# EAGLE design Control board V3 (EAGLE 8.3.2)
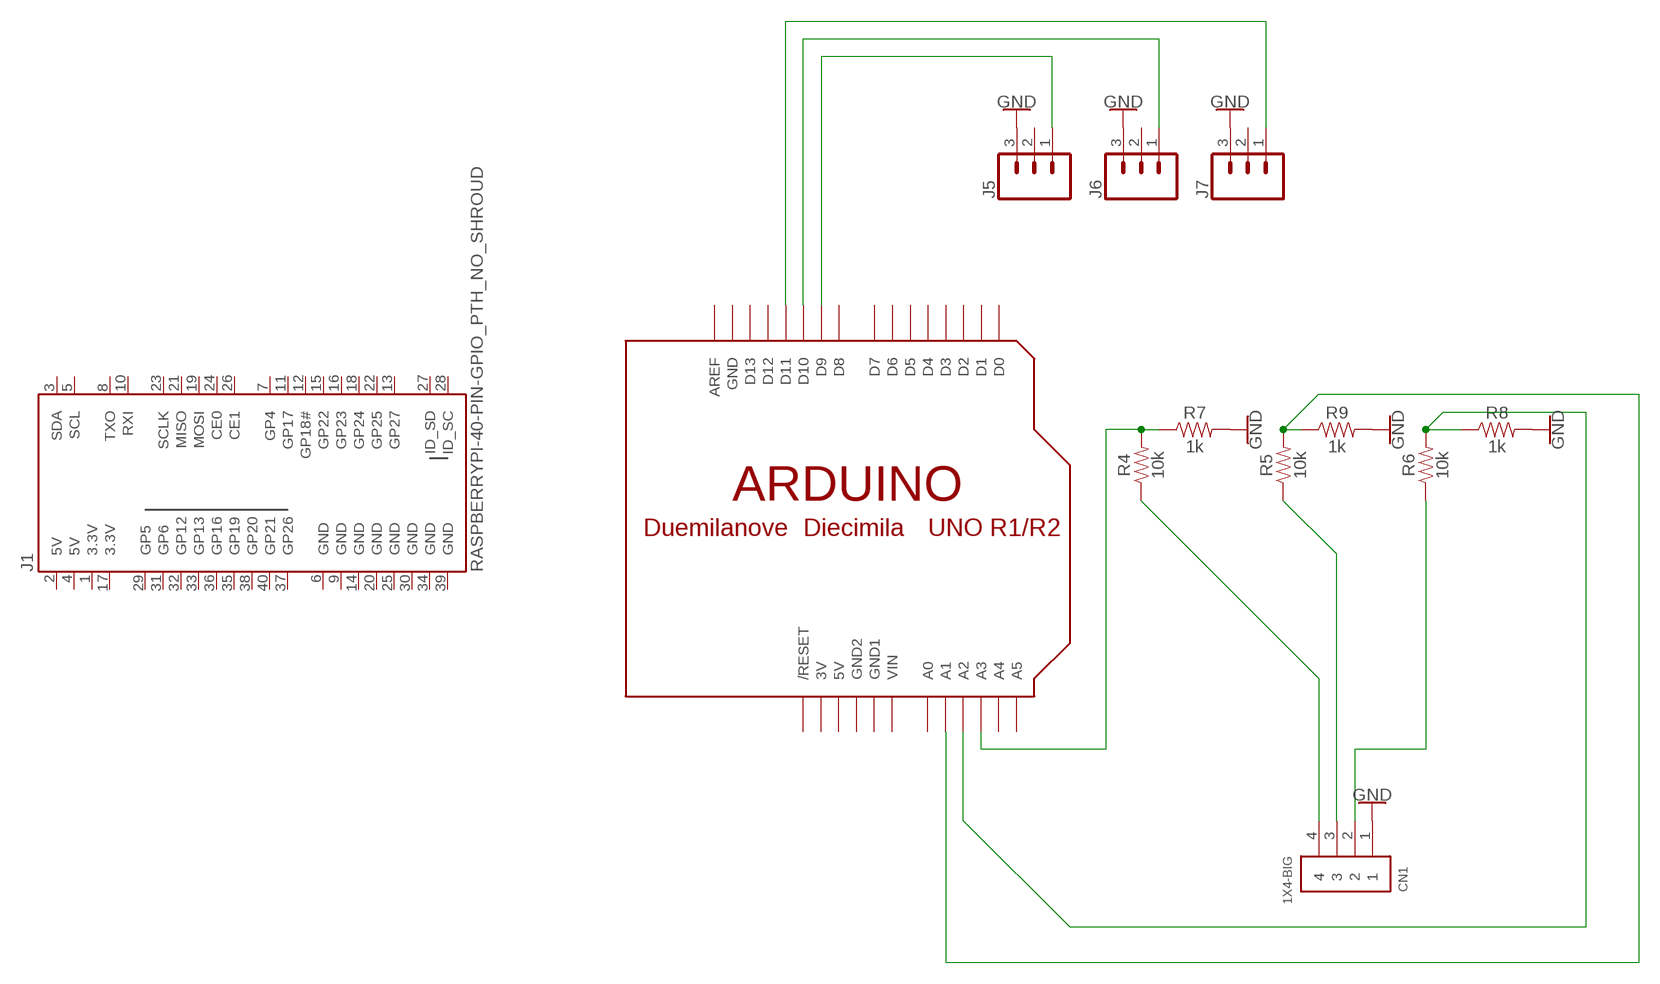
[diagram p0: schematic, sheet 1]

## Parts
CN1  1X4-BIG  [1X04-BIG]
J1  RASPBERRYPI-40-PIN-GPIO_PTH_NO_SHROUD  [2X20]
J5  CONN_03  [1X03]
J6  CONN_03  [1X03]
J7  CONN_03  [1X03]
R4  10k  10KOHM-HORIZ-1/4W-1%  [AXIAL-0.3]
R5  10k  10KOHM-HORIZ-1/4W-1%  [AXIAL-0.3]
R6  10k  10KOHM-HORIZ-1/4W-1%  [AXIAL-0.3]
R7  1k  1KOHM-HORIZ-1/4W-1%  [AXIAL-0.3]
R8  1k  1KOHM-HORIZ-1/4W-1%  [AXIAL-0.3]
R9  1k  1KOHM-HORIZ-1/4W-1%  [AXIAL-0.3]
U$1  ARDUINO-BPLACE  [ARDUINO-BPLACE]

## Nets
GND: CN1.1 J5.3 J6.3 J7.3 R7.P$2 R8.P$2 R9.P$2
N$2: J6.1 U$1.D10
N$3: J7.1 U$1.D11
N$4: R4.P$2 R7.P$1 U$1.A3
N$5: R6.P$2 R8.P$1 U$1.A2
N$6: CN1.3 R5.P$1
N$7: CN1.2 R6.P$1
N$8: J5.1 U$1.D9
N$10: CN1.4 R4.P$1
N$11: R5.P$2 R9.P$1 U$1.A1
Unconnected: J1.3(SDA) J1.5(SCL) J1.7(GP4) J1.8(TXO) J1.10(RXI) J1.11(GP17) J1.12(GP18#) J1.13(GP27) J1.15(GP22) J1.16(GP23) J1.18(GP24) J1.19(MOSI) J1.21(MISO) J1.22(GP25) J1.23(SCLK) J1.24(CE0) J1.26(CE1) J1.27(ID_SD) J1.28(ID_SC) J1.29(GP5) J1.31(GP6) J1.32(GP12) J1.33(GP13) J1.35(GP19) J1.36(GP16) J1.37(GP26) J1.38(GP20) J1.40(GP21) J5.2 J6.2 J7.2 U$1.A0 U$1.A4 U$1.A5 U$1.AREF U$1.D0 U$1.D1 U$1.D2 U$1.D3 U$1.D4 U$1.D5 U$1.D6 U$1.D7 U$1.D8 U$1.D12 U$1.D13 U$1.RESET(/RESET)

## Power pins joined to a net without a drawn wire
3.3V: J1.1(3.3V) J1.17(3.3V)
3V: U$1.3V
5V: J1.2(5V) J1.4(5V) U$1.5V
GND: J1.6(GND) J1.9(GND) J1.14(GND) J1.20(GND) J1.25(GND) J1.30(GND) J1.34(GND) J1.39(GND) U$1.GND
GND1: U$1.GND1
GND2: U$1.GND2
VIN: U$1.VIN

## Library data of the parts
CN1 = adafruit:1X4: 4-pin connector
J1 = SparkFun-Connectors:RASPBERRYPI-40-PIN-GPIO: Raspberry Pi GPIO Header 2x20 pin connector, as found on B, B+, A+ models. Both shrouded PTH and SMT versions available. SparkFun Products: GPIO Shrouded Header <https://www.sparkfun.com/products/13054>- PTH SparkFun Pi Wedge (Preassembled) <https://www.sparkfun.com/products/13717>
J5-J7 = SparkFun-Connectors:CONN_03: Multi connection point. Often used as Generic Header-pin footprint for 0.1 inch spaced/style header connections On any of the 0.1 inch spaced packages, you can populate with these: Break Away Headers - Straight <https://www.sparkfun.com/products/116> (PRT-00116) Break Away Male Headers - Right Angle <https://www.sparkfun.com/products/553> (PRT-00553) Female Headers <https://www.sparkfun.com/products/115> (PRT-00115) Break Away Headers - Machine Pin <https://www.sparkfun.com/products/117> (PRT-00117) Break Away Female Headers - Swiss Machine Pin <https://www.sparkfun.com/products/743> (PRT-00743) Stackable Header - 3 Pin (Female, 0.1") <https://www.sparkfun.com/products/13875> (PRT-13875) For SCREWTERMINALS and SPRING TERMINALS visit here: Screw Terimnals on SparkFun.com <https://www.sparkfun.com/search/results?term=Screw+Terminals> (5mm/3.5mm/2.54mm spacing) This device is also useful as a general connection point to wire up your design to another part of your project. Our various solder wires solder well into these plated through hole pads. Hook-Up Wire - Assortment (Stranded, 22 AWG) <https://www.sparkfun.com/products/11375> (PRT-11375) Hook-Up Wire - Assortment (Solid Core, 22 AWG) <https://www.sparkfun.com/products/11367> (PRT-11367) View the entire wire category on our website here <https://www.sparkfun.com/categories/141> Special notes: Molex polarized connector foot print use with SKU : PRT-08232 with associated crimp pins and housings.
R4-R6 = SparkFun-Resistors:10KOHM: 10kΩ resistor A resistor is a passive two-terminal electrical component that implements electrical resistance as a circuit element. Resistors act to reduce current flow, and, at the same time, act to lower voltage levels within circuits. - Wikipedia; PROD_ID: RES-12183
R7-R9 = SparkFun-Resistors:1KOHM: 1kΩ resistor A resistor is a passive two-terminal electrical component that implements electrical resistance as a circuit element. Resistors act to reduce current flow, and, at the same time, act to lower voltage levels within circuits. - Wikipedia; PROD_ID: RES-12182
U$1 = adafruit:ARDUINO: Arduino Diecimila/Duemilanove Make a shield with ease, this package has all the named pins as well as the two mounting drill holes and an outline of the USB and DC power connector. The outline is on the DIMENSION layer, so if your board house uses it they will cut the outline to match. http://www.ladyada.net/library/pcb/eaglelibrary.html

## Board
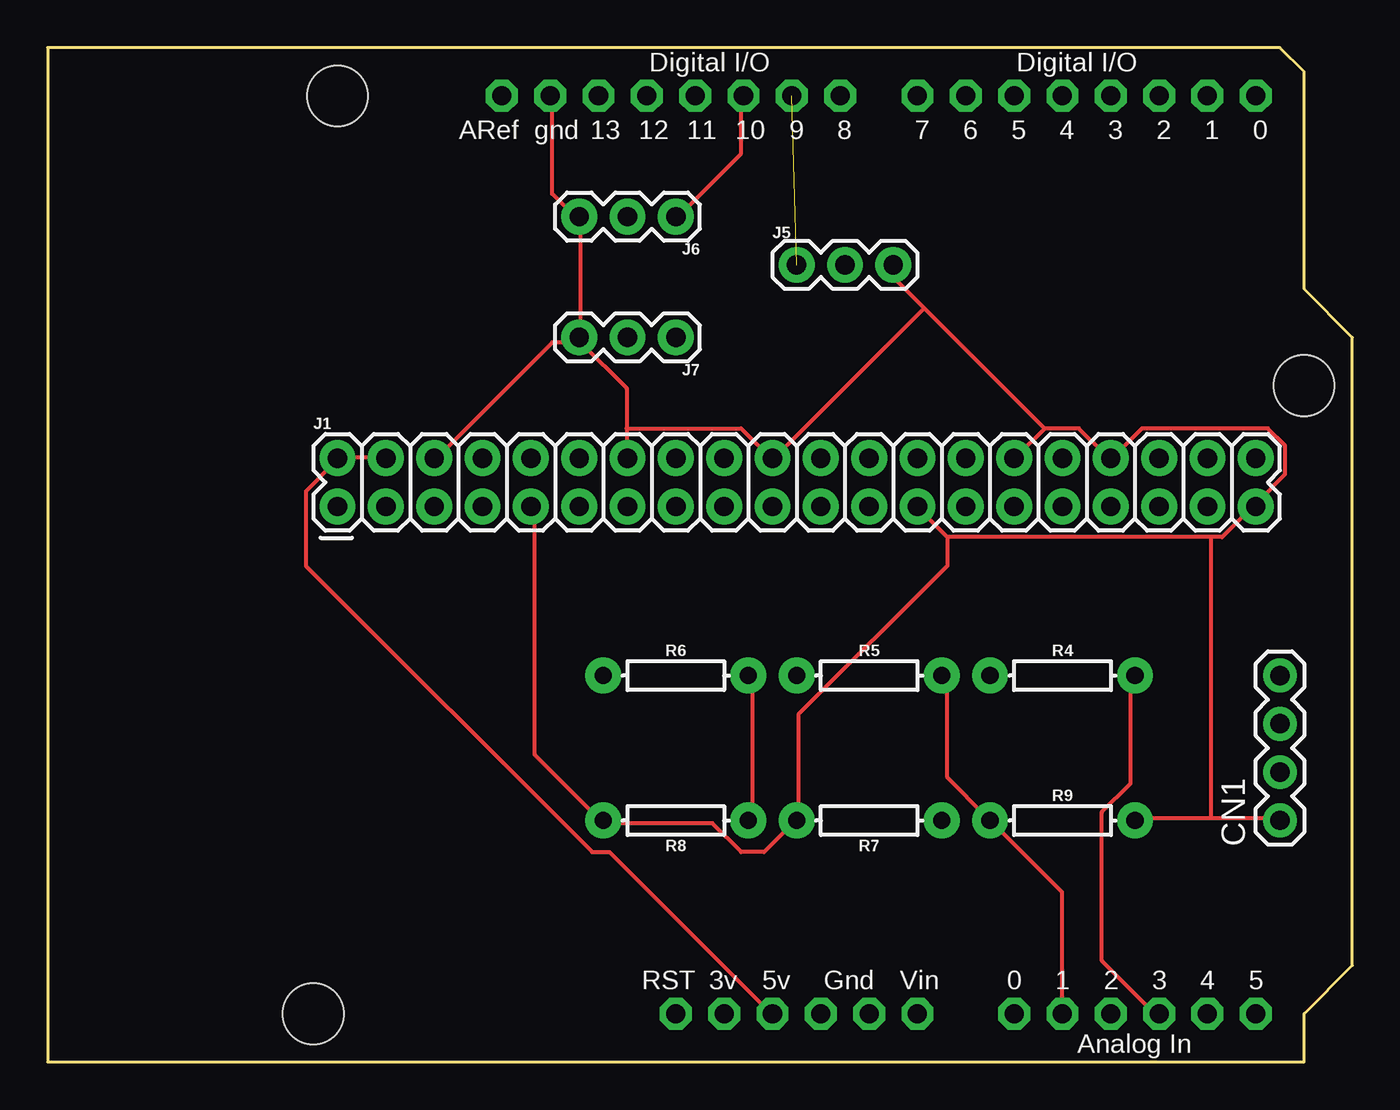
[diagram p1: board, top side]
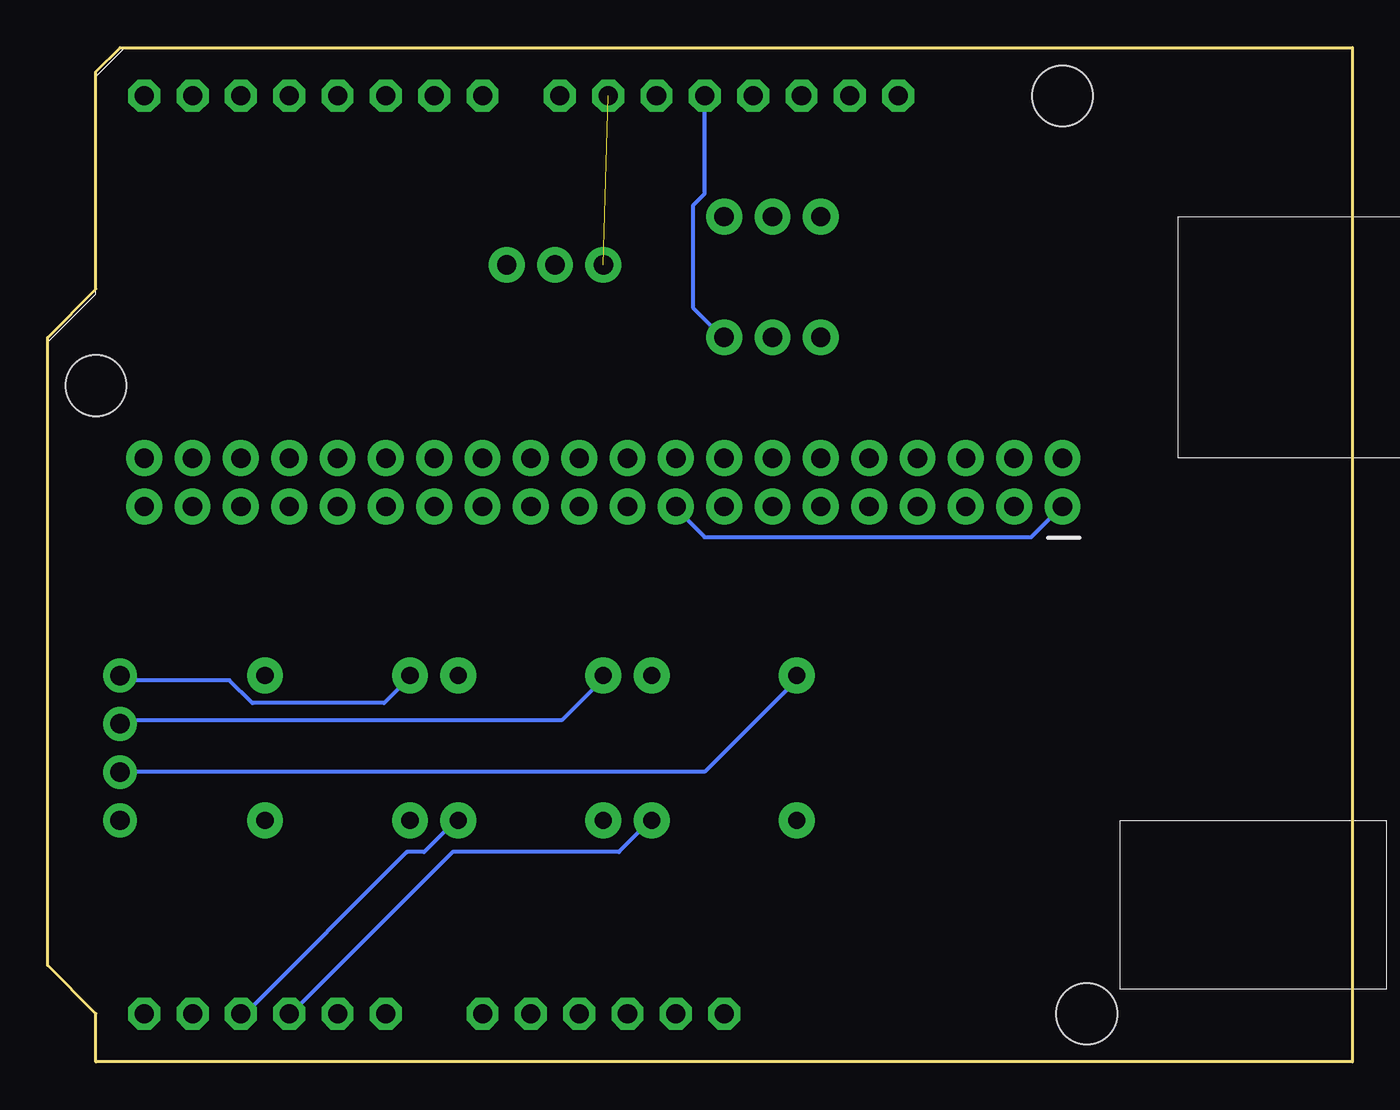
[diagram p2: board, bottom side, seen from below]

Size 68.58 x 53.34 mm. Coordinates in mm from the lower left corner, seen from the top.
Outline: 0,53.34 0,0 66.04,0 66.04,2.54 68.58,5.08 68.58,38.1 66.04,40.64 66.04,52.07 64.77,53.34 0,53.34
Copper layers (1*16): Top 0.035mm / dielectric 1.5mm / Bottom 0.035mm
Design rules "Othermill-DRC-1-64": minimum track width 8mil, minimum drill 0.8mm, track to track 0.39878125mm, track to pad 0.39878125mm, pad to pad 0.39878125mm, via to via 0.39878125mm, smd to smd 0mil, copper to edge 0mil, drill to drill 1mil, minimum pad ring 10mil, minimum via ring 10mil, stop-mask expansion 1mil, vias tented up to drill 30mil, thermal gap 10mil

### Footprints (pad centres in the part's own frame; a part is rotated, then mirrored left to right if it is on the bottom)
1X04-BIG = drill 1.016 pad 1.778: 1 0,0; 2 2.54,0; 3 5.08,0; 4 7.62,0
2X20 = drill 1.016 pad 1.88: 1 0,0; 2 0,2.54; 3 2.54,0; 4 2.54,2.54; 5 5.08,0; 6 5.08,2.54; 7 7.62,0; 8 7.62,2.54; 9 10.16,0; 10 10.16,2.54; 11 12.7,0; 12 12.7,2.54; 13 15.24,0; 14 15.24,2.54; 15 17.78,0; 16 17.78,2.54; 17 20.32,0; 18 20.32,2.54; 19 22.86,0; 20 22.86,2.54; 21 25.4,0; 22 25.4,2.54; 23 27.94,0; 24 27.94,2.54; 25 30.48,0; 26 30.48,2.54; 27 33.02,0; 28 33.02,2.54; 29 35.56,0; 30 35.56,2.54; 31 38.1,0; 32 38.1,2.54; 33 40.64,0; 34 40.64,2.54; 35 43.18,0; 36 43.18,2.54; 37 45.72,0; 38 45.72,2.54; 39 48.26,0; 40 48.26,2.54
1X03 = drill 1.016 pad 1.88: 1 0,0; 2 2.54,0; 3 5.08,0
AXIAL-0.3 = drill 0.9 pad 1.88: P$1 -3.81,0; P$2 3.81,0
ARDUINO-BPLACE = drill 1 pad 1.676 octagon: 3V 35.56,2.54; 5V 38.1,2.54; A0 50.8,2.54; A1 53.34,2.54; A2 55.88,2.54; A3 58.42,2.54; A4 60.96,2.54; A5 63.5,2.54; AREF 23.876,50.8; D0 63.5,50.8; D1 60.96,50.8; D2 58.42,50.8; D3 55.88,50.8; D4 53.34,50.8; D5 50.8,50.8; D6 48.26,50.8; D7 45.72,50.8; D8 41.656,50.8; D9 39.116,50.8; D10 36.576,50.8; D11 34.036,50.8; D12 31.496,50.8; D13 28.956,50.8; GND 26.416,50.8; GND1 43.18,2.54; GND2 40.64,2.54; RESET 33.02,2.54; VIN 45.72,2.54 | hole 3.2: 15.24,50.8; 66.04,35.56; 13.97,2.54

### Placement (x,y rotation side)
CN1  64.77,12.7 90 top
J1  15.24,29.21 0 top
J5  39.37,41.91 0 top
J6  33.02,44.45 180 top
J7  33.02,38.1 180 top
R4  53.34,20.32 0 top
R5  43.18,20.32 0 top
R6  33.02,20.32 0 top
R7  43.18,12.7 180 top
R8  33.02,12.7 180 top
R9  53.34,12.7 0 top
U$1  0,0 0 top

### Tracks (layer width: path | path; a pad name or v marks a point on that pad's centre or on a via)
3.3V
  Bottom 0.203: J1.1 15.38,29.1 16.89,27.6 34.04,27.6 35.55,29.1 J1.17
5V
  Top 0.203: U$1.5V 37.95,2.61 29.53,11.04 28.62,11.04 13.58,26.09 13.58,30 15.08,31.51 J1.2 15.38,31.81 17.49,31.81 J1.4
GND
  Top 0.203: 52.4,33.32 50.9,31.81 J1.30 | 52.4,33.32 54.21,33.32 55.71,31.81 J1.34 56.02,31.81 57.52,33.32 64.14,33.32 65.05,32.41 65.05,30.91 63.54,29.4 J1.39 63.24,29.1 61.73,27.6 61.13,27.6 | 52.4,33.32 46.08,39.64 | 46.08,39.64 44.58,41.14 44.58,41.74 J5.3 | U$1.GND 26.52,50.77 26.52,45.66 27.72,44.45 J6.3 28.02,44.15 28.02,38.13 J7.3 | J1.6 20.5,31.81 26.52,37.83 27.72,37.83 J7.3 | 30.43,33.32 30.43,35.42 28.02,37.83 J7.3 | 30.43,33.32 30.43,31.81 J1.14 | 30.43,33.32 36.45,33.32 37.95,31.81 J1.20 38.26,31.81 46.08,39.64 | J1.9 25.61,29.1 25.61,16.16 28.93,12.85 R8.P$2 29.23,12.55 34.95,12.55 36.45,11.04 37.65,11.04 39.16,12.55 R7.P$2 39.46,12.85 39.46,18.27 47.29,26.09 47.29,27.6 | 61.13,12.85 57.22,12.85 R9.P$2 | 61.13,12.85 64.74,12.85 CN1.1 | 47.29,27.6 45.78,29.1 J1.25 | 61.13,27.6 47.29,27.6 | 61.13,27.6 61.13,12.85
N$2
  Top 0.203: U$1.D10 36.45,50.77 36.45,47.76 33.14,44.45 J6.1
N$3
  Bottom 0.203: U$1.D11 34.04,50.77 34.04,45.66 34.64,45.05 34.64,39.64 33.14,38.13 J7.1
N$4
  Top 0.203: R4.P$2 56.92,20.07 56.92,14.65 55.41,13.15 55.41,5.32 58.12,2.61 U$1.A3
  Bottom 0.203: U$1.A3 58.12,2.61 49.69,11.04 48.79,11.04 47.29,12.55 R7.P$1
N$5
  Top 0.203: R6.P$2 37.05,20.07 37.05,12.85 R8.P$1
  Bottom 0.203: U$1.A2 55.71,2.61 47.29,11.04 38.56,11.04 37.05,12.55 R8.P$1
N$6
  Bottom 0.203: CN1.3 64.74,17.96 41.57,17.96 39.46,20.07 R5.P$1
N$7
  Bottom 0.203: CN1.2 64.74,15.25 34.04,15.25 29.23,20.07 R6.P$1
N$8  (1 unrouted)
N$10
  Bottom 0.203: CN1.4 64.74,20.07 59.03,20.07 57.82,18.87 50.9,18.87 49.69,20.07 R4.P$1
N$11
  Top 0.203: U$1.A1 53.31,2.61 53.31,8.93 49.69,12.55 R9.P$1 49.39,12.85 47.29,14.95 47.29,20.07 R5.P$2